# EAGLE schematic gearnode (EAGLE 5.10)
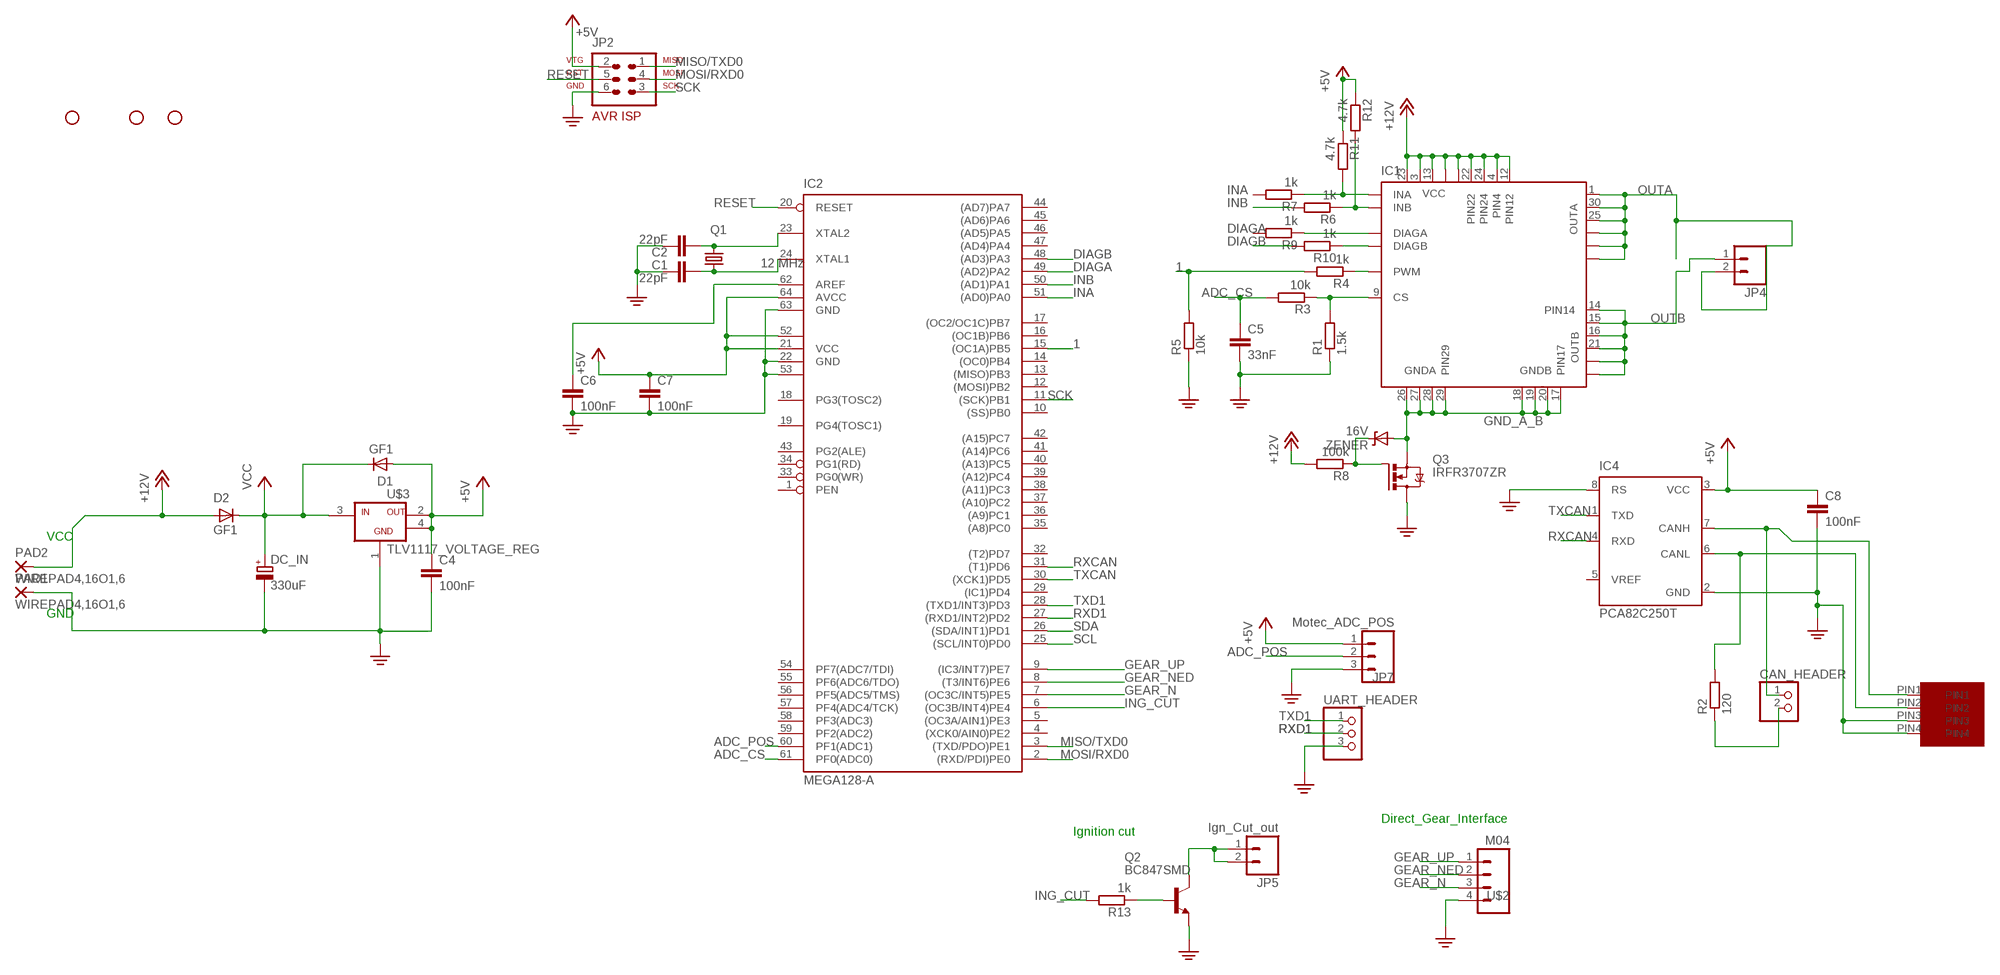
[diagram p0: schematic, sheet 1]

## Parts
C1  22pF  C5/2.5  [C5B2.5]
C2  22pF  C5/2.5  [C5B2.5]
C4  100nF  C-EUC0603K  [C0603K]
C5  33nF  C-EUC0603K  [C0603K]
C6  100nF  C-EUC0603K  [C0603K]
C7  100nF  C-EUC0603K  [C0603K]
C8  100nF  C-EUC0603K  [C0603K]
CAN_HEADER  PINHD-1X2  [1X02]
D1  GF1  [SMA-DO214AC]
D2  GF1  [SMA-DO214AC]
DC_IN  330uF  CPOL-EUE15-5AXIAL  [E15-5]
IC1  VNH2SP30  [MULTIPOWERSO-30]
IC2  MEGA128-A  [TQFP64]
IC4  PCA82C250T  [SO8]
JP1  STAND-OFF  [STAND-OFF]
JP2  AVR-ISP-6  [AVR-ISP-6]
JP3  STAND-OFF  [STAND-OFF]
JP4  M025MM  [SCREWTERMINAL-5MM-2]
JP5  Ign_Cut_out  M02-JST-2MM-SMT  [S2B-PH]
JP6  STAND-OFF  [STAND-OFF]
JP7  Motec_ADC_POS  M03  [S3B-PH]
PAD1  WIREPAD4,16O1,6  [4,16O1,6]
PAD2  WIREPAD4,16O1,6  [4,16O1,6]
Q1  12 MHz  CRYSTALHC49U70  [HC49U70]
Q2  BC847SMD  [SOT23]
Q3  IRFR3707ZR  [D-PAK_TO252AA]
R1  1.5k  R-EU_R0603  [R0603]
R2  120  R-EU_R0603  [R0603]
R3  10k  R-EU_R0603  [R0603]
R4  1k  R-EU_R0603  [R0603]
R5  10k  R-EU_R0603  [R0603]
R6  1k  R-EU_R0603  [R0603]
R7  1k  R-EU_R0603  [R0603]
R8  100k  R-EU_R0603  [R0603]
R9  1k  R-EU_R0603  [R0603]
R10  1k  R-EU_R0603  [R0603]
R11  4.7k  R-EU_R0603  [R0603]
R12  4.7k  R-EU_R0603  [R0603]
R13  1k  R-EU_R0603  [R0603]
U$1  MICROFIT4  [MICROFIT4SOCK]
U$2  M04  [S4B-PH]
U$3  TLV1117_VOLTAGE_REG  [SOT-232]
UART_HEADER  PINHD-1X3  [1X03]
ZENER  16V  DIODE-ZENER-BZT52  [SOD-323]

## Nets
1: IC2.15((OC1A)PB5) R4.2 R5.2
+5V: C4.1 C7.1 C8.1 D1.A IC2.21(VCC) IC2.52(VCC1) IC2.64(AVCC) IC4.3(VCC) JP2.2 JP7.1 R11.1 R12.1 U$3.2(VOUT) U$3.4(OUT2)
+12V: D2.A IC1.3(VCC) IC1.4(PIN4) IC1.12(PIN12) IC1.13(VCC) IC1.22(PIN22) IC1.23(VCC) IC1.24(PIN24) IC1.VCC IC1.VCC@1(VCC) PAD2.1(P) R8.2
ADC_CS: C5.1 IC2.61(PF0(ADC0)) R3.2
ADC_POS: IC2.60(PF1(ADC1)) JP7.2
CANJUMP1: CAN_HEADER.1 IC4.7(CANH) U$1.PIN1
CANJUMP2: CAN_HEADER.2 R2.1
DIAGA: IC2.49((AD2)PA2) R9.2
DIAGB: IC2.48((AD3)PA3) R10.2
GEAR_N: IC2.7((OC3C/INT5)PE5) U$2.3
GEAR_NED: IC2.8((T3/INT6)PE6) U$2.2
GEAR_UP: IC2.9((IC3/INT7)PE7) U$2.1
GND_A_B: IC1.17(PIN17) IC1.18(GNDB) IC1.19(GNDB) IC1.20(GNDB) IC1.26(GNDA) IC1.27(GNDA) IC1.28(GNDA) IC1.29(PIN29) Q3.3(S) ZENER.2(A)
INA: IC2.51((AD0)PA0) R7.2
INB: IC2.50((AD1)PA1) R6.2
ING_CUT: IC2.6((OC3B/INT4)PE4) R13.2
MISO/TXD0: IC2.3((TXD/PDO)PE1) JP2.1
MOSI/RXD0: IC2.2((RXD/PDI)PE0) JP2.4
N$1: C1.2 IC2.24(XTAL1) Q1.1
N$2: C2.2 IC2.23(XTAL2) Q1.2
N$3: IC1.8(PWM) R4.1
N$7: IC1.9(CS) R1.2 R3.1
N$8: Q3.1(G) R8.1 ZENER.1(C)
N$9: Q2.1(B) R13.1
N$10: C6.1 IC2.62(AREF)
N$11: JP5.1 JP5.2 Q2.3(C)
N$12: IC1.6(DIAGA) R9.1
N$14: IC1.10(DIAGB) R10.1
N$18: IC1.5(INA) R7.1 R11.2
N$19: IC1.11(INB) R6.1 R12.2
N$51: IC4.6(CANL) R2.2 U$1.PIN2
OUTA: IC1.1(OUTA) IC1.2(PIN2) IC1.25(OUTA) IC1.30(OUTA) IC1.OUTA IC1.OUTA@1(OUTA) JP4.2
OUTB: IC1.14(PIN14) IC1.15(OUTB) IC1.16(OUTB) IC1.21(OUTB) IC1.OUTB IC1.OUTB@1(OUTB) JP4.1
PE: C1.1 C2.1 C4.2 C5.2 C6.2 C7.2 C8.2 DC_IN.- IC2.22(GND) IC2.53(GND1) IC2.63(GND) IC4.2(GND) IC4.8(RS) JP2.6 JP7.3 PAD1.1(P) Q2.2(E) Q3.4(D) R1.1 R5.1 U$1.PIN3 U$1.PIN4 U$2.4 U$3.1(GND) UART_HEADER.3
RESET: IC2.20(RESET) JP2.5
RXCAN: IC2.31((T1)PD6) IC4.4(RXD)
RXD1: IC2.27((RXD1/INT2)PD2) UART_HEADER.2
SCK: IC2.11((SCK)PB1) JP2.3
SCL: IC2.25((SCL/INT0)PD0)
SDA: IC2.26((SDA/INT1)PD1)
TXCAN: IC2.30((XCK1)PD5) IC4.1(TXD)
TXD1: IC2.28((TXD1/INT3)PD3) UART_HEADER.1
VCC: D1.K(C) D2.K(C) DC_IN.+ U$3.3(VIN)
Unconnected: IC2.1(PEN) IC2.4((XCK0/AIN0)PE2) IC2.5((OC3A/AIN1)PE3) IC2.10((SS)PB0) IC2.12((MOSI)PB2) IC2.13((MISO)PB3) IC2.14((OC0)PB4) IC2.16((OC1B)PB6) IC2.17((OC2/OC1C)PB7) IC2.18(PG3(TOSC2)) IC2.19(PG4(TOSC1)) IC2.29((IC1)PD4) IC2.32((T2)PD7) IC2.33(PG0(WR)) IC2.34(PG1(RD)) IC2.35((A8)PC0) IC2.36((A9)PC1) IC2.37((A10)PC2) IC2.38((A11)PC3) IC2.39((A12)PC4) IC2.40((A13)PC5) IC2.41((A14)PC6) IC2.42((A15)PC7) IC2.43(PG2(ALE)) IC2.44((AD7)PA7) IC2.45((AD6)PA6) IC2.46((AD5)PA5) IC2.47((AD4)PA4) IC2.54(PF7(ADC7/TDI)) IC2.55(PF6(ADC6/TDO)) IC2.56(PF5(ADC5/TMS)) IC2.57(PF4(ADC4/TCK)) IC2.58(PF3(ADC3)) IC2.59(PF2(ADC2)) IC4.5(VREF)

## Notes on the sheet
- VCC
- GND
- Direct_Gear_Interface
- Ignition cut

## Library data of the parts
C1 C2 = capacitor-wima:C: CAPACITOR naming: grid - package width
C4-C8 = rcl:C-EU: CAPACITOR, European symbol
CAN_HEADER = pinhead:PINHD-1X2: PIN HEADER
D1 D2 = diode:GF1: DIODE
DC_IN = rcl:CPOL-EU: POLARIZED CAPACITOR, European symbol
IC1 = UNICORN:VNH2SP30: FULLY INTEGRATED H-BRIDGE MOTOR DRIVER Source: http://pdf1.alldatasheet.com/datasheet-pdf/view/84563/STMICROELECTRONICS/VNH3SP30.html
IC2 = atmel:MEGA128: MICROCONTROLLER 128 Kbytes FLASH 4 Kbytes SRAM 4 Kbytes EEPROM DUAL USART 8-channel 10 bit ADC Source: avr.lbr
IC4 = micro-philips:PCA82C250: CAN CONTROLLER INTERFACE
JP1 JP3 JP6 = SparkFun:STAND-OFF: Stand Off This is the mechanical footprint for a #4 phillips button head screw. Use the keepout ring to avoid running the screw head into surrounding components. SKU : PRT-00447
JP2 = avr-5:AVR-ISP-6: AVR ISP-6 Serial Programming Header
JP4 = SparkFun:M02: Header 2 Standard 2-pin 0.1" header. Use with straight break away headers (SKU : PRT-00116), right angle break away headers (PRT-00553), swiss pins (PRT-00743), machine pins (PRT-00117), and female headers (PRT-00115). Molex polarized connector foot print use with SKU : PRT-08233 with associated crimp pins and housings.
JP5 = unicorn_v2:M02: Header 2 Standard 2-pin 0.1" header. Use with straight break away headers (SKU : PRT-00116), right angle break away headers (PRT-00553), swiss pins (PRT-00743), machine pins (PRT-00117), and female headers (PRT-00115). Molex polarized connector foot print use with SKU : PRT-08233 with associated crimp pins and housings.
JP7 = unicorn_v2:M03: Header 2 Standard 2-pin 0.1" header. Use with straight break away headers (SKU : PRT-00116), right angle break away headers (PRT-00553), swiss pins (PRT-00743), machine pins (PRT-00117), and female headers (PRT-00115). Molex polarized connector foot print use with SKU : PRT-08233 with associated crimp pins and housings.
PAD1 PAD2 = wirepad:WIREPAD: Wire PAD connect wire on PCB
Q1 = crystal:CRYSTAL: CRYSTAL
Q2 = transistor-npn:BC847*: NPN Transistor
Q3 = UNICORN:IRFR3707Z: HEXFET Power MOSFET Source: http://www.irf.com/product-info/datasheets/data/irfr5305pbf.pdf
R1-R13 = resistor:R-EU_: RESISTOR, European symbol
U$1 = UNICORN:MICROFIT4
U$2 = unicorn_v2:M04
U$3 = unicorn_v2:TLV1117_VOLTAGE_REG
UART_HEADER = pinhead:PINHD-1X3: PIN HEADER
ZENER = SparkFun:DIODE-ZENER: Zener Diode Production Part - 8199 3.4V Zener Voltage